# Altium project roach2_project rev2.PrjPCB (part 5 of 13)

## Sheet ppc_net.SchDoc: PowePC Gigabit Ethernet
size A3; Date: DO NOT USE, RATHER USE PROJ OPTIONS; DrawnBy: DO NOT USE, RATHER USE PROJ OPTIONS; Engineer: DO NOT USE, RATHER USE PROJ OPTIONS; Organization: DO NOT USE, RATHER USE PROJ OPTIONS; DocumentNumber: DO NOT USE, RATHER USE PROJ OPTIONS; Revision: DO NOT USE, RATHER USE PROJ OPTIONS; SheetNumber: 11; SheetTotal: 27; SCH_Sheet_Filename: ppc_net.SchDoc; CurrentTime: DO NOT USE, RATHER USE PROJ OPTIONS; Time: DO NOT USE, RATHER USE PROJ OPTIONS; DocumentFullPathAndName: DO NOT USE, RATHER USE PROJ OPTIONS; DocumentName: DO NOT USE, RATHER USE PROJ OPTIONS; ModifiedDate: DO NOT USE, RATHER USE PROJ OPTIONS; ImagePath: DO NOT USE, RATHER USE PROJ OPTIONS
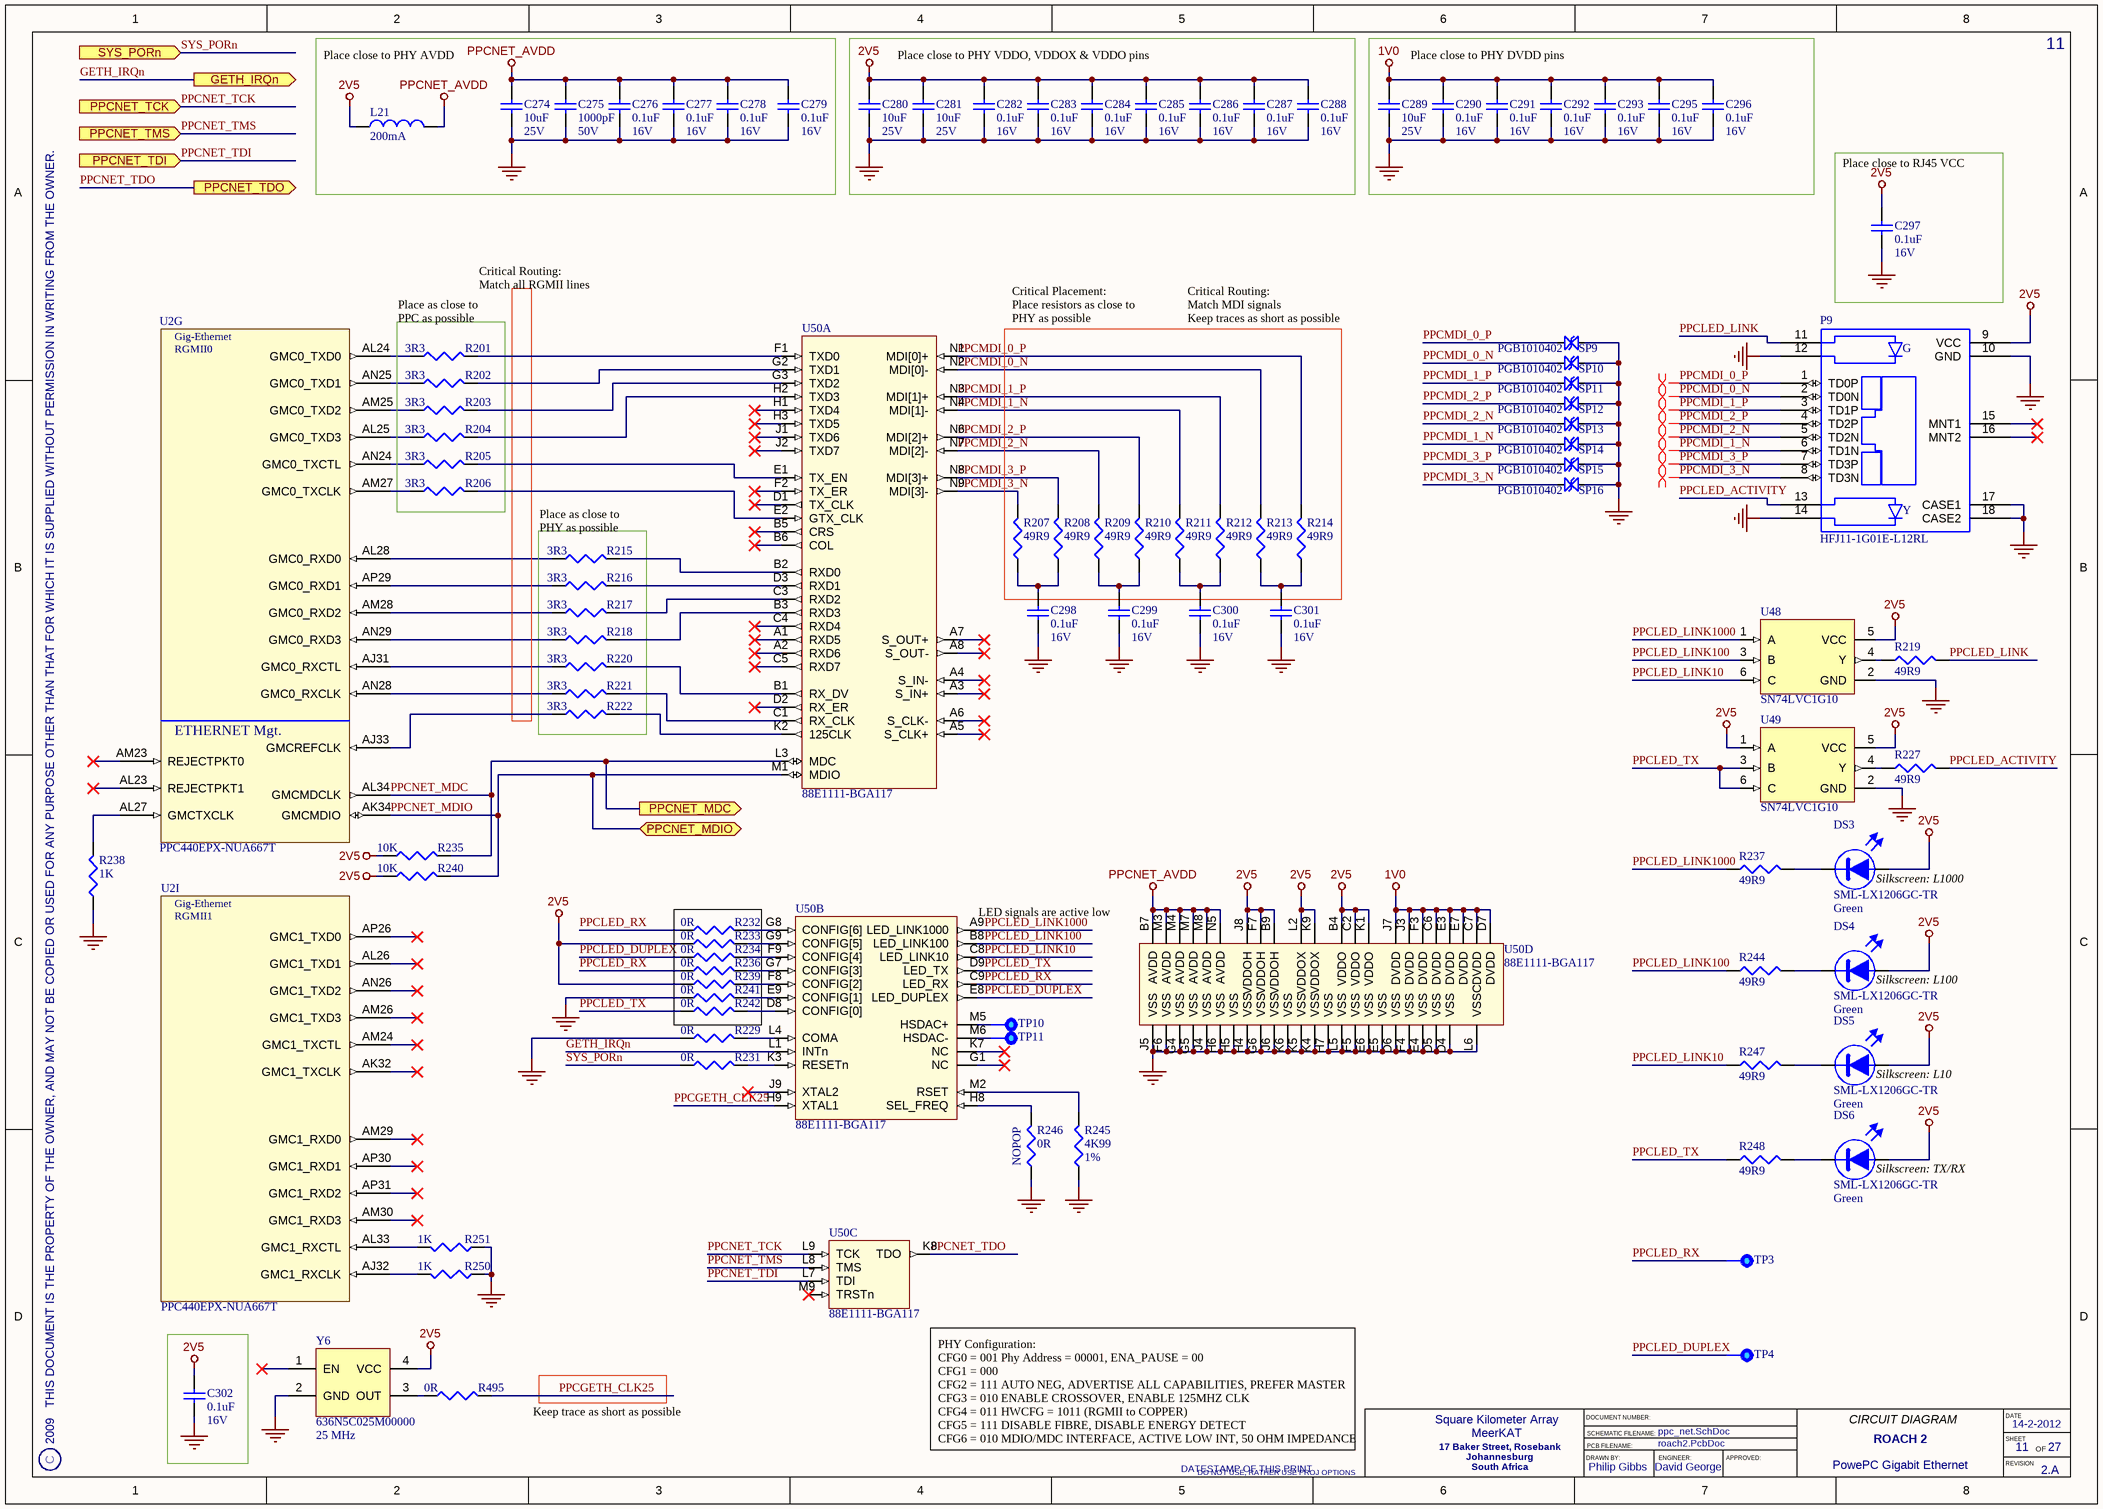
[diagram p8: ppc_net.SchDoc]

### Parts
C274  Rating: 25V  [CAPC3225X200L]  (hidden comment: 10uF)
C275  Rating: 50V  [CAPC1005X55L]  (hidden comment: 1000pF)
C276  Rating: 16V  [CAPC1005X60L]  (hidden comment: 0.1uF)
C277  Rating: 16V  [CAPC1005X60L]  (hidden comment: 0.1uF)
C278  Rating: 16V  [CAPC1005X60L]  (hidden comment: 0.1uF)
C279  Rating: 16V  [CAPC1005X60L]  (hidden comment: 0.1uF)
C280  Rating: 25V  [CAPC3225X200L]  (hidden comment: 10uF)
C281  Rating: 25V  [CAPC3225X200L]  (hidden comment: 10uF)
C282  Rating: 16V  [CAPC1005X60L]  (hidden comment: 0.1uF)
C283  Rating: 16V  [CAPC1005X60L]  (hidden comment: 0.1uF)
C284  Rating: 16V  [CAPC1005X60L]  (hidden comment: 0.1uF)
C285  Rating: 16V  [CAPC1005X60L]  (hidden comment: 0.1uF)
C286  Rating: 16V  [CAPC1005X60L]  (hidden comment: 0.1uF)
C287  Rating: 16V  [CAPC1005X60L]  (hidden comment: 0.1uF)
C288  Rating: 16V  [CAPC1005X60L]  (hidden comment: 0.1uF)
C289  Rating: 25V  [CAPC3225X200L]  (hidden comment: 10uF)
C290  Rating: 16V  [CAPC1005X60L]  (hidden comment: 0.1uF)
C291  Rating: 16V  [CAPC1005X60L]  (hidden comment: 0.1uF)
C292  Rating: 16V  [CAPC1005X60L]  (hidden comment: 0.1uF)
C293  Rating: 16V  [CAPC1005X60L]  (hidden comment: 0.1uF)
C295  Rating: 16V  [CAPC1005X60L]  (hidden comment: 0.1uF)
C296  Rating: 16V  [CAPC1005X60L]  (hidden comment: 0.1uF)
C297  Rating: 16V  [CAPC1005X60L]  (hidden comment: 0.1uF)
C298  Rating: 16V  [CAPC1005X60L]  (hidden comment: 0.1uF)
C299  Rating: 16V  [CAPC1005X60L]  (hidden comment: 0.1uF)
C300  Rating: 16V  [CAPC1005X60L]  (hidden comment: 0.1uF)
C301  Rating: 16V  [CAPC1005X60L]  (hidden comment: 0.1uF)
C302  Rating: 16V  [CAPC1005X60L]  (hidden comment: 0.1uF)
DS3  SML-LX1206GC-TR  Colour: Green  [LEDC3216X120N]
DS4  SML-LX1206GC-TR  Colour: Green  [LEDC3216X120N]
DS5  SML-LX1206GC-TR  Colour: Green  [LEDC3216X120N]
DS6  SML-LX1206GC-TR  Colour: Green  [LEDC3216X120N]
L21  Rating: 200mA  [INDC2012X130L]  (hidden comment: 600R)
P9  HFJ11-1G01E-L12RL  [HALO_HFJ11-1G02E-L55]
R201  3R3  [RESC1005X40L]
R202  3R3  [RESC1005X40L]
R203  3R3  [RESC1005X40L]
R204  3R3  [RESC1005X40L]
R205  3R3  [RESC1005X40L]
R206  3R3  [RESC1005X40L]
R207  49R9  [RESC1005X40L]
R208  49R9  [RESC1005X40L]
R209  49R9  [RESC1005X40L]
R210  49R9  [RESC1005X40L]
R211  49R9  [RESC1005X40L]
R212  49R9  [RESC1005X40L]
R213  49R9  [RESC1005X40L]
R214  49R9  [RESC1005X40L]
R215  3R3  [RESC1005X40L]
R216  3R3  [RESC1005X40L]
R217  3R3  [RESC1005X40L]
R218  3R3  [RESC1005X40L]
R219  49R9  [RESC1005X40L]
R220  3R3  [RESC1005X40L]
R221  3R3  [RESC1005X40L]
R222  3R3  [RESC1005X40L]
R227  49R9  [RESC1005X40L]
R229  0R  [RESC1005X40L]
R231  0R  [RESC1005X40L]
R232  0R  [RESC1005X40L]
R233  0R  [RESC1005X40L]
R234  0R  [RESC1005X40L]
R235  10K  [RESC1005X40L]
R236  0R  [RESC1005X40L]
R237  49R9  [RESC1005X40L]
R238  1K  [RESC1005X40L]
R239  0R  [RESC1005X40L]
R240  10K  [RESC1005X40L]
R241  0R  [RESC1005X40L]
R242  0R  [RESC1005X40L]
R244  49R9  [RESC1005X40L]
R245  Tolerance: 1%  [RESC1005X40L]  (hidden comment: 4K99)
R246  0R  [RESC1005X40L]
R247  49R9  [RESC1005X40L]
R248  49R9  [RESC1005X40L]
R250  1K  [RESC1005X40L]
R251  1K  [RESC1005X40L]
R495  0R  [RESC1005X40L]
SP9  PGB1010402  [PGB1010402]
SP10  PGB1010402  [PGB1010402]
SP11  PGB1010402  [PGB1010402]
SP12  PGB1010402  [PGB1010402]
SP13  PGB1010402  [PGB1010402]
SP14  PGB1010402  [PGB1010402]
SP15  PGB1010402  [PGB1010402]
SP16  PGB1010402  [PGB1010402]
TP3  Testpoint  [TP100]  (value not drawn)  (no BOM)
TP4  Testpoint  [TP100]  (value not drawn)  (no BOM)
TP10  Testpoint  [TP100]  (value not drawn)  (no BOM)
TP11  Testpoint  [TP100]  (value not drawn)  (no BOM)
U2  PPC440EPX-NUA667T  [TE-PBGA680]  (parts G,I of 11)
U48  SN74LVC1G10  [SOT23-6]
U49  SN74LVC1G10  [SOT23-6]
U50  88E1111-BGA117  [BGA117C100P13X9_1400X1000X154]  (parts A,B,C,D of 4)
Y6  Frequency: 25 MHz  [636XXXXXXMXXXXX]  (hidden comment: 636N5C025M00000)

### Ports
GETH_IRQn (out), PPCNET_MDC (out), PPCNET_MDIO (bidir), PPCNET_TCK (in), PPCNET_TDI (in), PPCNET_TDO (out), PPCNET_TMS (in), SYS_PORn (in)

### Nets
1V0: C289.2 C290.2 C291.2 C292.2 C293.2 C295.2 C296.2 U50.C6(DVDD) U50.C7(DVDD) U50.D7(DVDD) U50.E3(DVDD) U50.E7(DVDD) U50.F3(DVDD) U50.J3(DVDD) U50.J7(DVDD)
2V5: C280.2 C281.2 C282.2 C283.2 C284.2 C285.2 C286.2 C287.2 C288.2 C297.2 C302.2 DS3.2(A) DS4.2(A) DS5.2(A) DS6.2(A) L21.1 P9.9(VCC) R233.1 R235.1 R239.1 R240.1 U48.5(VCC) U49.1(A) U49.5(VCC) U50.B4(VDDO) U50.B9(VDDOH) U50.C2(VDDO) U50.F7(VDDOH) U50.J8(VDDOH) U50.K1(VDDO) U50.K9(VDDOX) U50.L2(VDDOX) Y6.4(VCC)
GND: C274.1 C275.1 C276.1 C277.1 C278.1 C279.1 C280.1 C281.1 C282.1 C283.1 C284.1 C285.1 C286.1 C287.1 C288.1 C289.1 C290.1 C291.1 C292.1 C293.1 C295.1 C296.1 C297.1 C298.2 C299.2 C300.2 C301.2 C302.1 P9.10(GND) P9.12(R1_YA_GC) P9.14(L1_YA_GC) P9.17(CASE1) P9.18(CASE2) R229.1 R238.1 R241.1 R245.1 R246.1 R250.1 R251.1 SP9.1(A) SP10.1(A) SP11.1(A) SP12.1(A) SP13.1(A) SP14.1(A) SP15.1(A) SP16.1(A) U48.2(GND) U49.2(GND) U50.D4(VSS) U50.D5(VSS) U50.D6(VSS) U50.E4(VSS) U50.E5(VSS) U50.E6(VSS) U50.F4(VSS) U50.F5(VSS) U50.F6(VSS) U50.G4(VSS) U50.G5(VSS) U50.G6(VSS) U50.H4(VSS) U50.H5(VSS) U50.H6(VSS) U50.H7(VSS) U50.J4(VSS) U50.J5(VSS) U50.J6(VSS) U50.K4(VSS) U50.K5(VSS) U50.K6(VSS) U50.L5(VSS) U50.L6(VSSC) Y6.2(GND)
PPCNET_AVDD: C274.2 C275.2 C276.2 C277.2 C278.2 C279.2 L21.2 U50.B7(AVDD) U50.M3(AVDD) U50.M4(AVDD) U50.M7(AVDD) U50.M8(AVDD) U50.N5(AVDD)
GETH_IRQn: U50.L1(INTn) ; port GETH_IRQn
PPCGETH_CLK25: R495.2 U50.H9(XTAL1)
PPCLED_ACTIVITY: P9.13(L1_YC_GA) R227.2
PPCLED_DUPLEX: R234.1 TP4.1 U50.E8(LED_DUPLEX)
PPCLED_LINK: P9.11(R1_YC_GA) R219.2
PPCLED_LINK10: R247.1 U48.6(C) U50.C8(LED_LINK10)
PPCLED_LINK100: R244.1 U48.3(B) U50.B8(LED_LINK100)
PPCLED_LINK1000: R237.1 U48.1(A) U50.A9(LED_LINK1000)
PPCLED_RX: R232.1 R236.1 TP3.1 U50.C9(LED_RX)
PPCLED_TX: R242.1 R248.1 U49.3(B) U49.6(C) U50.D9(LED_TX)
PPCMDI_0_N: P9.2(TD0N) R213.2 SP10.2(B) U50.N2(MDI[0]-)
PPCMDI_0_P: P9.1(TD0P) R214.2 SP9.2(B) U50.N1(MDI[0]+)
PPCMDI_1_N: P9.6(TD1N) R211.2 SP14.2(B) U50.N4(MDI[1]-)
PPCMDI_1_P: P9.3(TD1P) R212.2 SP11.2(B) U50.N3(MDI[1]+)
PPCMDI_2_N: P9.5(TD2N) R209.2 SP13.2(B) U50.N7(MDI[2]-)
PPCMDI_2_P: P9.4(TD2P) R210.2 SP12.2(B) U50.N6(MDI[2]+)
PPCMDI_3_N: P9.8(TD3N) R207.2 SP16.2(B) U50.N9(MDI[3]-)
PPCMDI_3_P: P9.7(TD3P) R208.2 SP15.2(B) U50.N8(MDI[3]+)
PPCNET_MDC: R235.2 U2.AL34(GMCMDCLK) U50.L3(MDC) ; port PPCNET_MDC
PPCNET_MDIO: R240.2 U2.AK34(GMCMDIO) U50.M1(MDIO) ; port PPCNET_MDIO
PPCNET_TCK: U50.L9(TCK) ; port PPCNET_TCK
PPCNET_TDI: U50.L7(TDI) ; port PPCNET_TDI
PPCNET_TDO: U50.K8(TDO) ; port PPCNET_TDO
PPCNET_TMS: U50.L8(TMS) ; port PPCNET_TMS
SYS_PORn: R231.1 ; port SYS_PORn
NetC298_1: C298.1 R207.1 R208.1
NetC299_1: C299.1 R209.1 R210.1
NetC300_1: C300.1 R211.1 R212.1
NetC301_1: C301.1 R213.1 R214.1
NetDS3_1: DS3.1(K) R237.2
NetDS4_1: DS4.1(K) R244.2
NetDS5_1: DS5.1(K) R247.2
NetDS6_1: DS6.1(K) R248.2
NetR201_1: R201.1 U2.AL24(GMC0_TXD0)
NetR201_2: R201.2 U50.F1(TXD0)
NetR202_1: R202.1 U2.AN25(GMC0_TXD1)
NetR202_2: R202.2 U50.G2(TXD1)
NetR203_1: R203.1 U2.AM25(GMC0_TXD2)
NetR203_2: R203.2 U50.G3(TXD2)
NetR204_1: R204.1 U2.AL25(GMC0_TXD3)
NetR204_2: R204.2 U50.H2(TXD3)
NetR205_1: R205.1 U2.AN24(GMC0_TXCTL)
NetR205_2: R205.2 U50.E1(TX_EN)
NetR206_1: R206.1 U2.AM27(GMC0_TXCLK)
NetR206_2: R206.2 U50.E2(GTX_CLK)
NetR215_1: R215.1 U2.AL28(GMC0_RXD0)
NetR215_2: R215.2 U50.B2(RXD0)
NetR216_1: R216.1 U2.AP29(GMC0_RXD1)
NetR216_2: R216.2 U50.D3(RXD1)
NetR217_1: R217.1 U2.AM28(GMC0_RXD2)
NetR217_2: R217.2 U50.C3(RXD2)
NetR218_1: R218.1 U2.AN29(GMC0_RXD3)
NetR218_2: R218.2 U50.B3(RXD3)
NetR219_1: R219.1 U48.4(Y)
NetR220_1: R220.1 U2.AJ31(GMC0_RXCTL)
NetR220_2: R220.2 U50.B1(RX_DV)
NetR221_1: R221.1 U2.AN28(GMC0_RXCLK)
NetR221_2: R221.2 U50.C1(RX_CLK)
NetR222_1: R222.1 U2.AJ33(GMCREFCLK)
NetR222_2: R222.2 U50.K2(125CLK)
NetR227_1: R227.1 U49.4(Y)
NetR229_2: R229.2 U50.L4(COMA)
NetR231_2: R231.2 U50.K3(RESETn)
NetR232_2: R232.2 U50.G8(CONFIG[6])
NetR233_2: R233.2 U50.G9(CONFIG[5])
NetR234_2: R234.2 U50.F9(CONFIG[4])
NetR236_2: R236.2 U50.G7(CONFIG[3])
NetR238_2: R238.2 U2.AL27(GMCTXCLK)
NetR239_2: R239.2 U50.F8(CONFIG[2])
NetR241_2: R241.2 U50.E9(CONFIG[1])
NetR242_2: R242.2 U50.D8(CONFIG[0])
NetR245_2: R245.2 U50.M2(RSET)
NetR246_2: R246.2 U50.H8(SEL_FREQ)
NetR250_2: R250.2 U2.AJ32(GMC1_RXCLK)
NetR251_2: R251.2 U2.AL33(GMC1_RXCTL)
NetR495_1: R495.1 Y6.3(OUT)
NetTP10_1: TP10.1 U50.M5(HSDAC+)
NetTP11_1: TP11.1 U50.M6(HSDAC-)

Not connected (* = marked no-connect by the designer): P9 15(MNT1)* 16(MNT2)*; U2 AK32(GMC1_TXCLK)* AL23(REJECTPKT1)* AL26(GMC1_TXD1)* AM23(REJECTPKT0)* AM24(GMC1_TXCTL)* AM26(GMC1_TXD3)* AM29(GMC1_RXD0)* AM30(GMC1_RXD3)* AN26(GMC1_TXD2)* AP26(GMC1_TXD0)* AP30(GMC1_RXD1)* AP31(GMC1_RXD2)*; U50 A1(RXD5)* A2(RXD6)* A3(S_IN+)* A4(S_IN-)* A5(S_CLK+)* A6(S_CLK-)* A7(S_OUT+)* A8(S_OUT-)* B5(CRS)* B6(COL)* C4(RXD4)* C5(RXD7)* D1(TX_CLK)* D2(RX_ER)* F2(TX_ER)* G1(NC)* H1(TXD4)* H3(TXD5)* J1(TXD6)* J2(TXD7)* J9(XTAL2)* K7(NC)* M9(TRSTn)*; Y6 1(EN)*

### Layout directives
differential pair: PPCMDI_0_N, PPCMDI_0_P, PPCMDI_1_N, PPCMDI_1_P, PPCMDI_2_N, PPCMDI_2_P, PPCMDI_3_N, PPCMDI_3_P

### Notes on the sheet
- Place close to PHY AVDD
- Place close to PHY VDDO, VDDOX & VDDO pins
- Place close to PHY DVDD pins
- (near C297) Place close to RJ45 VCC
- (near R201) Place as close to
  PPC as possible
- Critical Routing:
  Match all RGMII lines
- Critical Placement:
  Place resistors as close to
  PHY as possible
- Critical Routing:
  Match MDI signals
  Keep traces as short as possible
- (near R215) Place as close to
  PHY as possible
- (near U50) LED signals are active low
- (near DS3) Silkscreen: L1000
- (near DS4) Silkscreen: L100
- (near DS5) Silkscreen: L10
- (near R246) NOPOP
- (near DS6) Silkscreen: TX/RX
- Keep trace as short as possible
- (near U50) PHY Configuration:
  CFG0 = 001 Phy Address = 00001, ENA_PAUSE = 00
  CFG1 = 000
  CFG2 = 111 AUTO NEG, ADVERTISE ALL CAPABILITIES, PREFER MASTER
  CFG3 = 010 ENABLE CROSSOVER, ENABLE 125MHZ CLK
  CFG4 = 011 HWCFG = 1011 (RGMII to COPPER)
  CFG5 = 111 DISABLE FIBRE, DISABLE ENERGY DETECT
  CFG6 = 010 MDIO/MDC INTERFACE, ACTIVE LOW INT, 50 OHM IMPEDANCE
- 2009   THIS DOCUMENT IS THE PROPERTY OF THE OWNER, AND MAY NOT BE COPIED OR USED FOR ANY PURPOSE OTHER THAN THAT FOR WHICH IT IS SUPPLIED WITHOUT PERMISSION IN WRITING FROM THE OWNER.
- C
- DATESTAMP OF THIS PRINT
- DRAWN BY:
- DOCUMENT NUMBER:
- SCHEMATIC FILENAME:
- PCB FILENAME:
- ENGINEER:
- APPROVED:
- CIRCUIT DIAGRAM
- DATE
- SHEET
- REVISION
- OF
- (in symbol CONN-PCB-4) G
- (in symbol IC-CPU-1, part G) Gig-Ethernet; RGMII0; ETHERNET Mgt.
- (in symbol IC-CPU-1, part I) Gig-Ethernet; RGMII1

### Library data of the parts
C274 C280 C281 C289 = CAP-CER-5: 10uF, Ceramic Capacitor; Manufacturer: MURATA; PartNum: GRM32DR61E106KA12L; Tolerance: 10%; Dielectric: X5R; POD number: CAP-CER-5; Value: 10uF; RoHS: Y; Sort Value: 100; Category: Capacitors; Subcategory: Ceramic
C275 = CAP-CER-4: 1000pF, Ceramic Capacitor; Manufacturer: MURATA; PartNum: GRM155R61H102KA01D; Tolerance: 10%; Dielectric: X5R; POD number: CAP-CER-4; Value: 1000pF; RoHS: Y; Sort Value: 0.0001; Category: Capacitors; Subcategory: Ceramic
C276-C279 C282-C288 C290-C293 C295-C302 = CAP-CER-1: 0.1uF, Ceramic Capacitor; Manufacturer: VENKEL; PartNum: C0402X7R160-104KN; Tolerance: 10%; Dielectric: X7R; POD number: CAP-CER-1; Value: 0.1uF; RoHS: Y; Sort Value: 0.1; Category: Capacitors; Subcategory: Ceramic
DS3-DS6 = OPTO-LED-0: Green, Surface mount, LED, 1206; Manufacturer: LUMEX; Vdrop: 2.2V; Rating: 20mA; POD number: OPTO-LED-0; PartNum: SML-LX1206GC-TR; RoHS: Y; Category: OPTO; Subcategory: LED
L21 = IND-FB-0: 600 Ohm, Chip Ferrite Bead; Manufacturer: Murata; PartNum: BLM21BD601SN1; DC Res: 0.35R; Tolerance: 25%; POD number: IND-FB-0; RoHS: Y; Value: 600R; Sort Value: 600; Category: Inductors; Subcategory: FerriteBead
P9 = CONN-PCB-4: RJ45 with Integrated magnetic and dual LEDs; Manufacturer: HALO; POD number: CONN-PCB-4; PartNum: HFJ11-1G01E-L12RL; RoHS: Y; Category: CONN; Subcategory: PCB
R201-R206 R215-R218 R220-R222 = RES-TF-24: 3R3, 1.1mm x 0.5mm, Thick Film Resistor; Manufacturer: ROYALOHM; PartNum: 0402WGJ330KT1E; Tolerance: 5%; Rating: 0.0625W; POD number: RES-TF-24; Value: 3R3; Sort Value: 3R3; Category: Resistors; Subcategory: ThickFilm; HelpURL: *.pdf
R207-R214 R219 R227 R237 R244 R247 R248 = RES-TF-10: 49R9, 1.1mm x 0.5mm, Thick Film Resistor; Manufacturer: ROYALOHM; PartNum: 0402WGF499JT1E; Tolerance: 1%; Rating: 0.0625W; POD number: RES-TF-10; Value: 49R9; Sort Value: 49.9; Category: Resistors; Subcategory: ThickFilm; HelpURL: *.pdf
R229 R231-R234 R236 R239 R241 R242 R246 R495 = RES-TF-0: 0R, 1.1mm x 0.5mm, Thick Film Resistor; Manufacturer: ROYALOHM; PartNum: 0402WG00000T1E; Tolerance: 0%; Rating: 0.0625W; POD number: RES-TF-0; Value: 0R; Sort Value: 0; Category: Resistors; Subcategory: ThickFilm; HelpURL: *.pdf
R235 R240 = RES-TF-5: 10K, 1.1mm x 0.5mm, Thick Film Resistor; Manufacturer: ROYALOHM; PartNum: 0402WGJ0103T1E; Tolerance: 5%; Rating: 0.0625W; POD number: RES-TF-5; Value: 10K; Sort Value: 10000; Category: Resistors; Subcategory: ThickFilm; HelpURL: *.pdf
R238 R250 R251 = RES-TF-8: 1K, 1.1mm x 0.5mm, Thick Film Resistor; Manufacturer: ROYALOHM; PartNum: 0402WGJ0102T1E; Tolerance: 5%; Rating: 0.0625W; POD number: RES-TF-8; Value: 1K; Sort Value: 1000; Category: Resistors; Subcategory: ThickFilm; HelpURL: *.pdf
R245 = RES-TF-13: 4K99, 1.1mm x 0.5mm, Thick Film Resistor; Manufacturer: ROYALOHM; PartNum: 0402WGF4991T1E; Rating: 0.0625W; POD number: RES-TF-13; Value: 4K99; Sort Value: 4990; Category: Resistors; Subcategory: ThickFilm; HelpURL: *.pdf
SP9-SP16 = ELMECH-ESD-3: Surface Mount Polymeric ESD Suppressor in an 0402 package; POD number: ELMECH-ESD-3; PartNum: PGB1010402
TP3 TP4 TP10 TP11 = ELMECH-TP-0: 1mm Diameter, through-hole, Circular Test-point; POD number: ELMECH-TP-0; RoHS: Y; Category: ELMECH; Subcategory: Test Points
U2 = IC-CPU-1: 667MHz, non-RoHS, PPC440EPx uProcessor; Manufacturer: Applied Micro; POD number: IC-CPU-1; PartNum: PPC440EPX-NUA667T; RoHS: Y; Category: IC; Subcategory: CPU
U48 U49 = IC-LOG-3: Single 3-input Positive-NAND gate; Manufacturer: Texas Instruments; POD number: IC-LOG-3; PartNum: SN74LVC1G10; RoHS: Y; Category: IC; Subcategory: Logic
U50 = IC-PHY-1: Integrated 10/100/1000 Ultra Gigabit Ethernet Transceiver; Manufacturer: Marvell; PartNum: 88E1111-XX-BAB1C000; POD number: IC-PHY-1; RoHS: Y; Category: IC; Subcategory: Network PHY
Y6 = RESN-CLK-5: 25.00 MHz, 2V5, CTS 636 clock oscillator; Stability: 50 PPM; POD number: RESN-CLK-5; PartNum: 636N5C025M00000; Manufacturer: CTS; RoHS: Y; Category: RESN; Subcategory: Clock Oscillators

## Sheet ppc_serial.SchDoc: PowerPC Serial Interfaces
size A3; Date: DO NOT USE, RATHER USE PROJ OPTIONS; DrawnBy: DO NOT USE, RATHER USE PROJ OPTIONS; Engineer: DO NOT USE, RATHER USE PROJ OPTIONS; Organization: DO NOT USE, RATHER USE PROJ OPTIONS; DocumentNumber: DO NOT USE, RATHER USE PROJ OPTIONS; Revision: DO NOT USE, RATHER USE PROJ OPTIONS; SheetNumber: 7; SheetTotal: 27; SCH_Sheet_Filename: ppc_serial.SchDoc; CurrentTime: DO NOT USE, RATHER USE PROJ OPTIONS; Time: DO NOT USE, RATHER USE PROJ OPTIONS; DocumentFullPathAndName: DO NOT USE, RATHER USE PROJ OPTIONS; DocumentName: DO NOT USE, RATHER USE PROJ OPTIONS; ModifiedDate: DO NOT USE, RATHER USE PROJ OPTIONS; ImagePath: DO NOT USE, RATHER USE PROJ OPTIONS
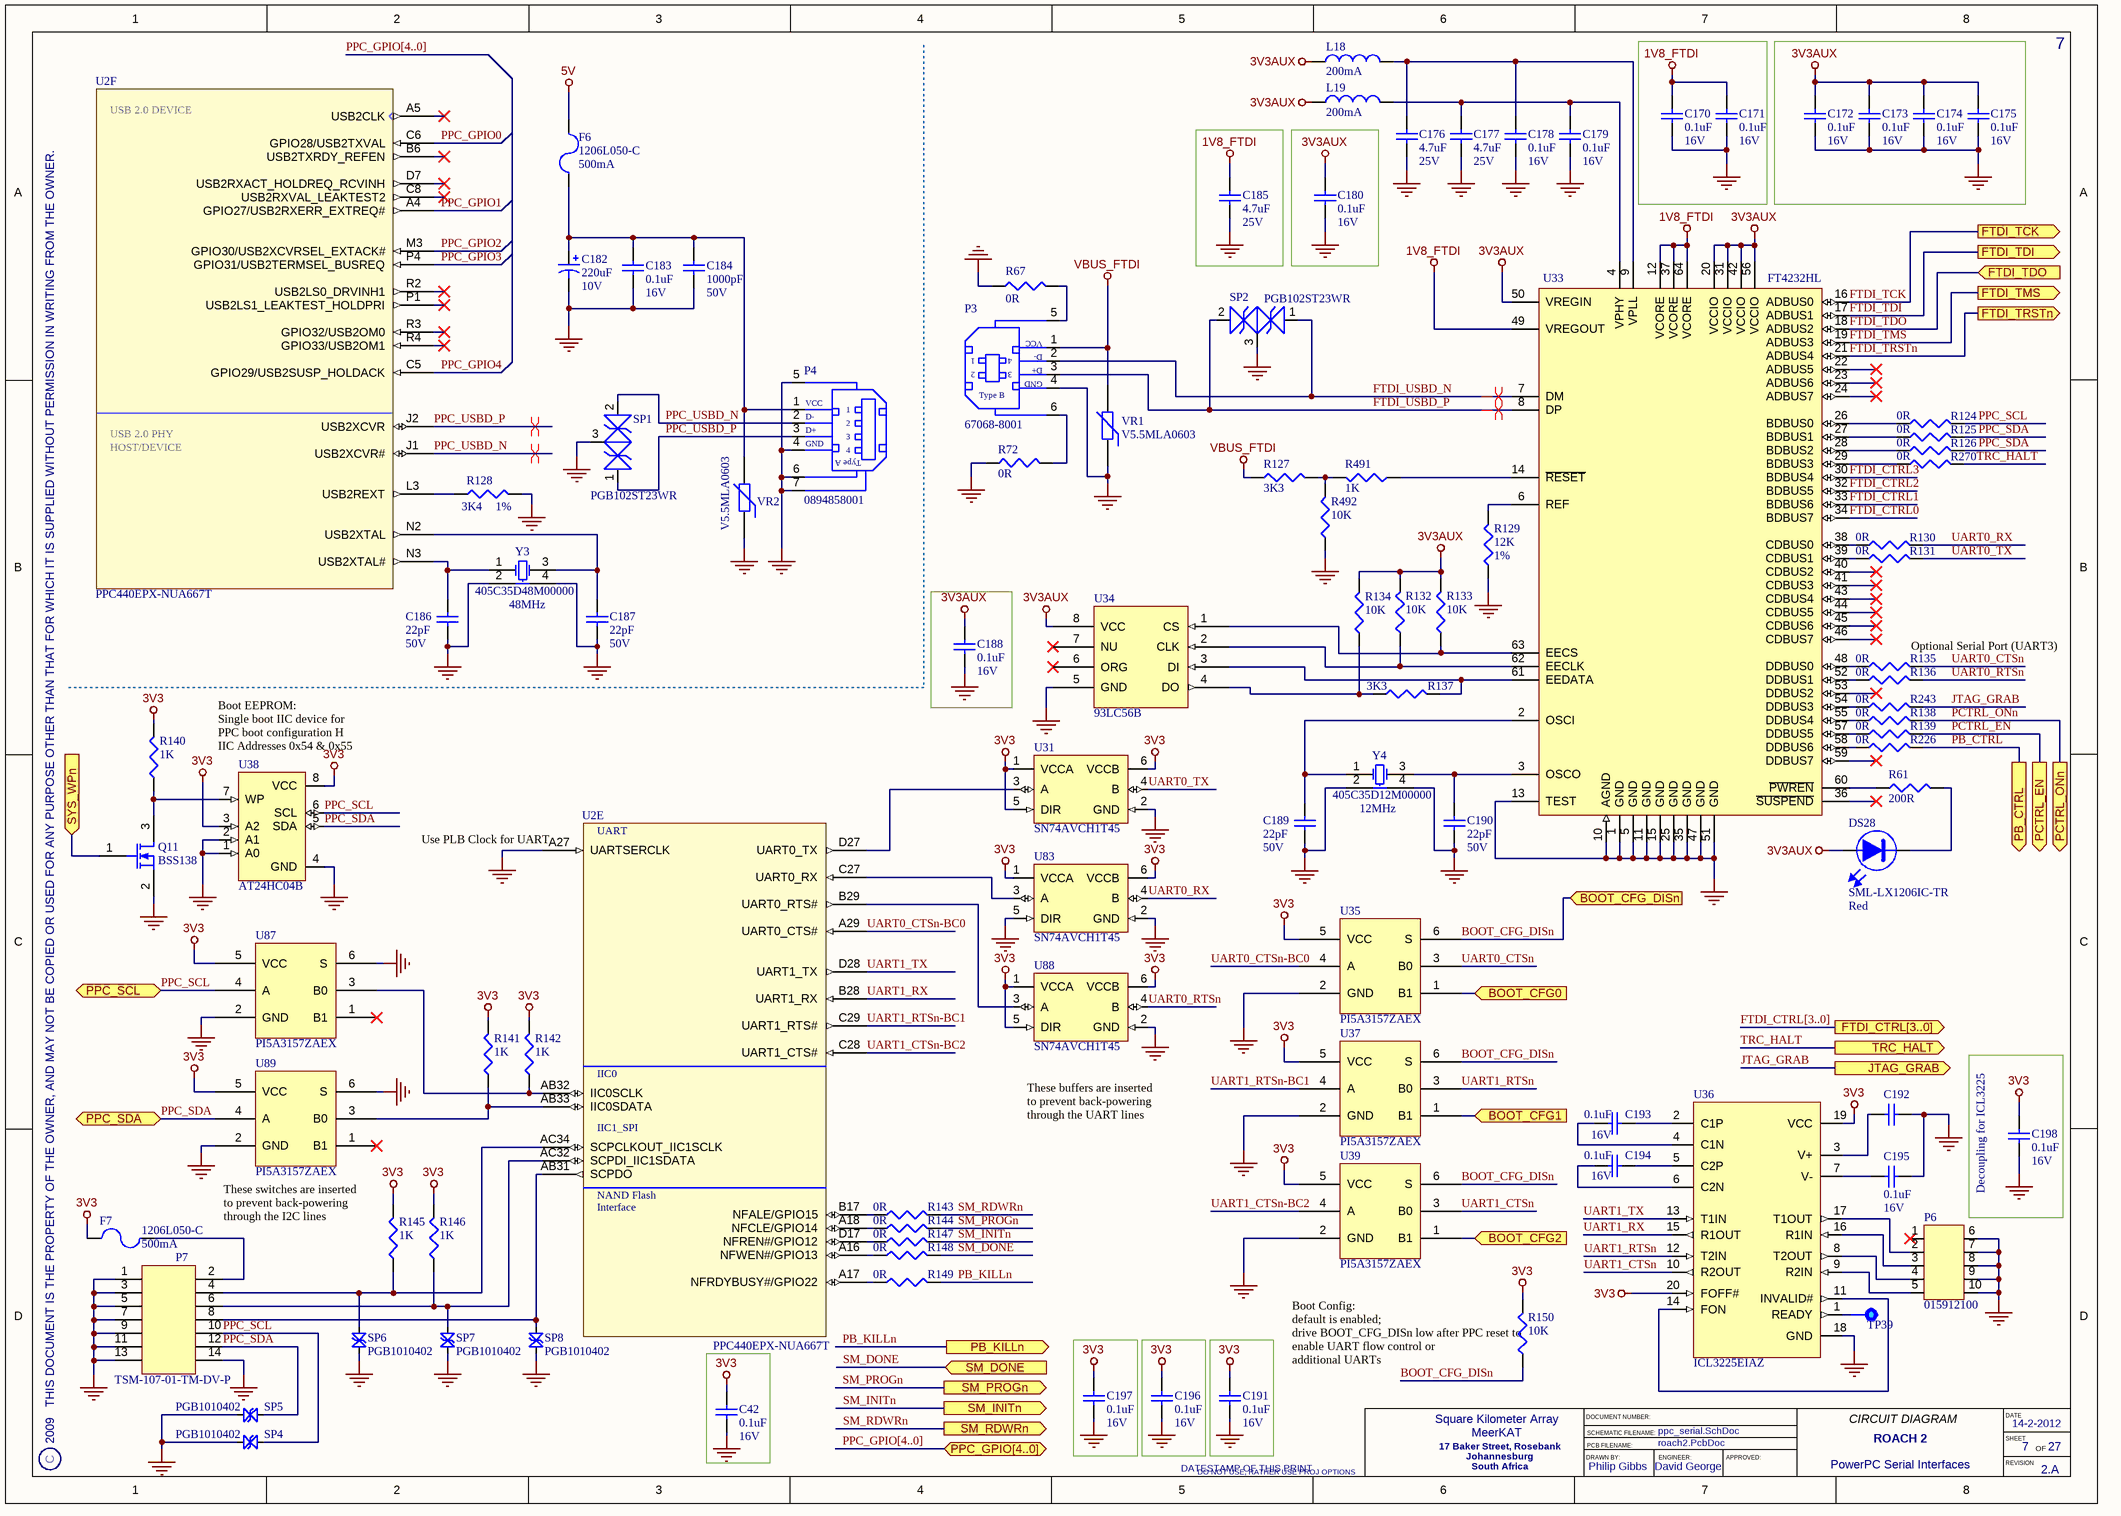
[diagram p9: ppc_serial.SchDoc]

### Parts
(Parts that share a designator on the sheet are numbered #1, #2 ... from top to bottom, then left to right.)
C42  Rating: 16V  [CAPC1005X60L]  (hidden comment: 0.1uF)
C170  Rating: 16V  [CAPC1005X60L]  (hidden comment: 0.1uF)
C171  Rating: 16V  [CAPC1005X60L]  (hidden comment: 0.1uF)
C172  Rating: 16V  [CAPC1005X60L]  (hidden comment: 0.1uF)
C173  Rating: 16V  [CAPC1005X60L]  (hidden comment: 0.1uF)
C174  Rating: 16V  [CAPC1005X60L]  (hidden comment: 0.1uF)
C175  Rating: 16V  [CAPC1005X60L]  (hidden comment: 0.1uF)
C176  Rating: 25V  [CAPC2012X127L]  (hidden comment: 4.7uF)
C177  Rating: 25V  [CAPC2012X127L]  (hidden comment: 4.7uF)
C178  Rating: 16V  [CAPC1005X60L]  (hidden comment: 0.1uF)
C179  Rating: 16V  [CAPC1005X60L]  (hidden comment: 0.1uF)
C180  Rating: 16V  [CAPC1005X60L]  (hidden comment: 0.1uF)
C182  Rating: 10V  [CAPMP7343X430L]  (hidden comment: 220uF)
C183  Rating: 16V  [CAPC1005X60L]  (hidden comment: 0.1uF)
C184  Rating: 50V  [CAPC1005X55L]  (hidden comment: 1000pF)
C185  Rating: 25V  [CAPC2012X127L]  (hidden comment: 4.7uF)
C186  Rating: 50V  [CAPC1005X55L]  (hidden comment: 22pF)
C187  Rating: 50V  [CAPC1005X55L]  (hidden comment: 22pF)
C188  Rating: 16V  [CAPC1005X60L]  (hidden comment: 0.1uF)
C189  Rating: 50V  [CAPC1005X55L]  (hidden comment: 22pF)
C190  Rating: 50V  [CAPC1005X55L]  (hidden comment: 22pF)
C191  Rating: 16V  [CAPC1005X60L]  (hidden comment: 0.1uF)
C192  (no value)  [CAPC1005X60L]
C193  Rating: 16V  [CAPC1005X60L]  (hidden comment: 0.1uF)
C194  Rating: 16V  [CAPC1005X60L]  (hidden comment: 0.1uF)
C195  Rating: 16V  [CAPC1005X60L]  (hidden comment: 0.1uF)
C196  Rating: 16V  [CAPC1005X60L]  (hidden comment: 0.1uF)
C197  Rating: 16V  [CAPC1005X60L]  (hidden comment: 0.1uF)
C198  Rating: 16V  [CAPC1005X60L]  (hidden comment: 0.1uF)
DS28  SML-LX1206IC-TR  Colour: Red  [LEDC3216X120N]
F6  Rating: 500mA  [FUSMC3215X145]  (hidden comment: 1206L050-C)
F7  Rating: 500mA  [FUSMC3215X145]  (hidden comment: 1206L050-C)
L18  Rating: 200mA  [INDC2012X130L]  (hidden comment: 600R)
L19  Rating: 200mA  [INDC2012X130L]  (hidden comment: 600R)
P3  67068-8001  [MOLEX_67068-8001]
P4  USB_TYPEA_TYCO  [MOLEX_0894858001]  (value not drawn)
P6  015912100  [MOLEX_0015912100]
P7  TSM-107-01-TM-DV-P  [SAMTEC_TSM-107-01-TM-DV-P]
Q11  BSS138  [SOT95P245X110-3N]
R61  200R  [RESC1005X40L]
R67  0R  [RESC1005X40L]
R72  0R  [RESC1005X40L]
R124  0R  [RESC1005X40L]
R125  0R  [RESC1005X40L]
R126  0R  [RESC1005X40L]
R127  3K3  [RESC1005X40L]
R128  Tolerance: 1%  [RESC1005X40L]  (hidden comment: 3K4)
R129  Tolerance: 1%  [RESC1005X40L]  (hidden comment: 12K)
R130  0R  [RESC1005X40L]
R131  0R  [RESC1005X40L]
R132  10K  [RESC1005X40L]
R133  10K  [RESC1005X40L]
R134  10K  [RESC1005X40L]
R135#2  0R  [RESC1005X40L]
R136#2  0R  [RESC1005X40L]
R137  3K3  [RESC1005X40L]
R138  0R  [RESC1005X40L]
R139  0R  [RESC1005X40L]
R140  1K  [RESC1005X40L]
R141  1K  [RESC1005X40L]
R142  1K  [RESC1005X40L]
R143  0R  [RESC1005X40L]
R144  0R  [RESC1005X40L]
R145  1K  [RESC1005X40L]
R146  1K  [RESC1005X40L]
R147  0R  [RESC1005X40L]
R148  0R  [RESC1005X40L]
R149  0R  [RESC1005X40L]
R150  10K  [RESC1005X40L]
R226  0R  [RESC1005X40L]
R243  0R  [RESC1005X40L]
R270  0R  [RESC1005X40L]
R491  1K  [RESC1005X40L]
R492  10K  [RESC1005X40L]
SP1  PGB102ST23WR  [SOT95P245X110-3N]
SP2  PGB102ST23WR  [SOT95P245X110-3N]
SP4  PGB1010402  [PGB1010402]
SP5  PGB1010402  [PGB1010402]
SP6  PGB1010402  [PGB1010402]
SP7  PGB1010402  [PGB1010402]
SP8  PGB1010402  [PGB1010402]
TP39  Testpoint  [TP100]  (value not drawn)  (no BOM)
U2  PPC440EPX-NUA667T  [TE-PBGA680]  (parts E,F of 11)
U31  SN74AVCH1T45  [SOT23-6]
U33  FT4232HL  [QFN64]
U34  93LC56B  [SOIC150-8_N]
U35  PI5A3157ZAEX  [SC70-6]
U36  ICL3225EIAZ  [SSOP20_M]
U37  PI5A3157ZAEX  [SC70-6]
U38  AT24HC04B  [TSSOP-8A2]
U39  PI5A3157ZAEX  [SC70-6]
U83  SN74AVCH1T45  [SOT23-6]
U87  PI5A3157ZAEX  [SC70-6]
U88  SN74AVCH1T45  [SOT23-6]
U89  PI5A3157ZAEX  [SC70-6]
VR1  V5.5MLA0603  [VAR_V5_5MLA0603]
VR2  V5.5MLA0603  [VAR_V5_5MLA0603]
Y3  PartNum: 405C35D48M00000  Frequency: 48MHz  [405XXXXXXMXXXXX]  (hidden comment: 405XXXXXXMXXXXX)
Y4  Frequency: 12MHz  [405XXXXXXMXXXXX]  (hidden comment: 405C35D12M00000)

### Blocks framed on the sheet
Decoupling for ICL3225: C198

### Ports
BOOT_CFG0 (in), BOOT_CFG1 (in), BOOT_CFG2 (in), BOOT_CFG_DISn (in), FTDI_CTRL[3..0] (out), FTDI_TCK (out), FTDI_TDI (out), FTDI_TDO (in), FTDI_TMS (out), FTDI_TRSTn (out), JTAG_GRAB (out), PB_CTRL (out), PB_KILLn (out), PCTRL_EN (out), PCTRL_ONn (out), PPC_GPIO[4..0] (bidir), PPC_SCL (bidir), PPC_SDA (bidir), SM_DONE (in), SM_INITn (out), SM_PROGn (out), SM_RDWRn (out), SYS_WPn (in), TRC_HALT (out)

### Nets
1V8_FTDI: C170.2 C171.2 C185.2 U33.12(VCORE) U33.37(VCORE) U33.49(VREGOUT) U33.64(VCORE)
3V3: C42.2 C191.2 C196.2 C197.2 C198.2 F7.2 R140.2 R141.2 R142.2 R145.2 R146.2 R150.2 U31.1(VCCA) U31.5(DIR) U31.6(VCCB) U35.5(VCC) U36.19(VCC) U36.20(FOFF#) U37.5(VCC) U38.3(A2) U38.8(VCC) U39.5(VCC) U83.1(VCCA) U83.6(VCCB) U87.5(VCC) U88.1(VCCA) U88.5(DIR) U88.6(VCCB) U89.5(VCC)
3V3AUX: C172.2 C173.2 C174.2 C175.2 C180.2 C188.2 DS28.2(A) L18.1 L19.1 R132.2 R133.2 R134.2 U33.20(VCCIO) U33.31(VCCIO) U33.42(VCCIO) U33.50(VREGIN) U33.56(VCCIO) U34.8(VCC)
5V: F6.2
GND: C42.1 C170.1 C171.1 C172.1 C173.1 C174.1 C175.1 C176.1 C177.1 C178.1 C179.1 C180.1 C182.2 C183.1 C184.1 C185.1 C186.1 C187.1 C188.1 C189.1 C190.1 C191.1 C192.1 C195.1 C196.1 C197.1 C198.1 P3.4 P4.4 P4.5 P4.6 P4.7 P6.6 P6.7 P6.8 P6.9 P6.10 P7.1 P7.3 P7.5 P7.7 P7.9 P7.11 P7.13 P7.14 Q11.2(S) R67.1 R72.1 R128.2 R129.1 R492.1 SP1.3(COM) SP2.3(COM) SP4.2(B) SP5.2(B) SP6.1(A) SP7.1(A) SP8.1(A) U2.A27(UARTSERCLK) U31.2(GND) U33.1(GND) U33.5(GND) U33.10(AGND) U33.11(GND) U33.13(TEST) U33.15(GND) U33.25(GND) U33.35(GND) U33.47(GND) U33.51(GND) U34.5(GND) U35.2(GND) U36.18(GND) U37.2(GND) U38.1(A0) U38.2(A1) U38.4(GND) U39.2(GND) U83.2(GND) U83.5(DIR) U87.2(GND) U87.6(S) U88.2(GND) U89.2(GND) U89.6(S) VR1.1 VR2.1 Y3.2 Y3.4 Y4.2 Y4.4
VBUS_FTDI: P3.1 R127.1 VR1.2
BOOT_CFG0: U35.1(B1) ; port BOOT_CFG0
BOOT_CFG1: U37.1(B1) ; port BOOT_CFG1
BOOT_CFG2: U39.1(B1) ; port BOOT_CFG2
BOOT_CFG_DISn: R150.1 U35.6(S) U37.6(S) U39.6(S) ; port BOOT_CFG_DISn
FTDI_CTRL0: U33.34(BDBUS7)
FTDI_CTRL1: U33.33(BDBUS6)
FTDI_CTRL2: U33.32(BDBUS5)
FTDI_CTRL3: U33.30(BDBUS4)
FTDI_TCK: U33.16(ADBUS0) ; port FTDI_TCK
FTDI_TDI: U33.17(ADBUS1) ; port FTDI_TDI
FTDI_TDO: U33.18(ADBUS2) ; port FTDI_TDO
FTDI_TMS: U33.19(ADBUS3) ; port FTDI_TMS
FTDI_TRSTn: U33.21(ADBUS4) ; port FTDI_TRSTn
FTDI_USBD_N: P3.2 SP2.1(A) U33.7(DM)
FTDI_USBD_P: P3.3 SP2.2(B) U33.8(DP)
JTAG_GRAB: R243.2 ; port JTAG_GRAB
PB_CTRL: R226.2 ; port PB_CTRL
PB_KILLn: R149.2 ; port PB_KILLn
PCTRL_EN: R139.2 ; port PCTRL_EN
PCTRL_ONn: R138.2 ; port PCTRL_ONn
PPC_GPIO0: U2.C6(GPIO28/USB2TXVAL)
PPC_GPIO1: U2.A4(GPIO27/USB2RXERR_EXTREQ#)
PPC_GPIO2: U2.M3(GPIO30/USB2XCVRSEL_EXTACK#)
PPC_GPIO3: U2.P4(GPIO31/USB2TERMSEL_BUSREQ)
PPC_GPIO4: U2.C5(GPIO29/USB2SUSP_HOLDACK)
PPC_SCL: P7.10 R124.2 SP4.1(A) U38.6(SCL) U87.4(A) ; port PPC_SCL
PPC_SDA: P7.12 R125.2 R126.2 SP5.1(A) U38.5(SDA) U89.4(A) ; port PPC_SDA
PPC_USBD_N: P4.2 SP1.2(B) U2.J1(USB2XCVR#)
PPC_USBD_P: P4.3 SP1.1(A) U2.J2(USB2XCVR)
SM_DONE: R148.2 ; port SM_DONE
SM_INITn: R147.2 ; port SM_INITn
SM_PROGn: R144.2 ; port SM_PROGn
SM_RDWRn: R143.2 ; port SM_RDWRn
SYS_WPn: Q11.1(G) ; port SYS_WPn
TRC_HALT: R270.2 ; port TRC_HALT
UART0_CTSn: R135#2.2 U35.3(B0)
UART0_CTSn-BC0: U2.A29(UART0_CTS#) U35.4(A)
UART0_RTSn: R136#2.2 U88.4(B)
UART0_RX: R130.2 U83.4(B)
UART0_TX: R131.2 U31.4(B)
UART1_CTSn: U36.10(R2OUT) U39.3(B0)
UART1_CTSn-BC2: U2.C28(UART1_CTS#) U39.4(A)
UART1_RTSn: U36.12(T2IN) U37.3(B0)
UART1_RTSn-BC1: U2.C29(UART1_RTS#) U37.4(A)
UART1_RX: U2.B28(UART1_RX) U36.15(R1OUT)
UART1_TX: U2.D28(UART1_TX) U36.13(T1IN)
NetC176_2: C176.2 C178.2 L18.2 U33.9(VPLL)
NetC177_2: C177.2 C179.2 L19.2 U33.4(VPHY)
NetC182_1: C182.1 C183.2 C184.2 F6.1 P4.1 VR2.2
NetC186_2: C186.2 U2.N3(USB2XTAL#) Y3.1
NetC187_2: C187.2 U2.N2(USB2XTAL) Y3.3
NetC189_2: C189.2 U33.2(OSCI) Y4.1
NetC190_2: C190.2 U33.3(OSCO) Y4.3
NetC192_2: C192.2 U36.3(V+)
NetC193_1: C193.1 U36.2(C1P)
NetC193_2: C193.2 U36.4(C1N)
NetC194_1: C194.1 U36.5(C2P)
NetC194_2: C194.2 U36.6(C2N)
NetC195_2: C195.2 U36.7(V-)
NetDS28_1: DS28.1(K) R61.2
NetF7_1: F7.1 P7.2
NetP3_5: P3.5 R67.2
NetP3_6: P3.6 R72.2
NetP6_2: P6.2 U36.17(T1OUT)
NetP6_3: P6.3 U36.16(R1IN)
NetP6_4: P6.4 U36.8(T2OUT)
NetP6_5: P6.5 U36.9(R2IN)
NetP7_4: P7.4 R145.1 SP6.2(B) U2.AC34(SCPCLKOUT_IIC1SCLK)
NetP7_6: P7.6 R146.1 SP7.2(B) U2.AC32(SCPDI_IIC1SDATA)
NetP7_8: P7.8 SP8.2(B) U2.AB31(SCPDO)
NetQ11_3: Q11.3(D) R140.1 U38.7(WP)
NetR61_1: R61.1 U33.60(~{PWREN})
NetR124_1: R124.1 U33.26(BDBUS0)
NetR125_1: R125.1 U33.27(BDBUS1)
NetR126_1: R126.1 U33.28(BDBUS2)
NetR127_2: R127.2 R491.2 R492.2
NetR128_1: R128.1 U2.L3(USB2REXT)
NetR129_2: R129.2 U33.6(REF)
NetR130_1: R130.1 U33.38(CDBUS0)
NetR131_1: R131.1 U33.39(CDBUS1)
NetR132_1: R132.1 U33.62(EECLK) U34.2(CLK)
NetR133_1: R133.1 U33.63(EECS) U34.1(CS)
NetR134_1: R134.1 R137.1 U34.4(DO)
NetR135#2_1: R135#2.1 U33.48(DDBUS0)
NetR136#2_1: R136#2.1 U33.52(DDBUS1)
NetR137_2: R137.2 U33.61(EEDATA) U34.3(DI)
NetR138_1: R138.1 U33.55(DDBUS4)
NetR139_1: R139.1 U33.57(DDBUS5)
NetR141_1: R141.1 U2.AB33(IIC0SDATA) U89.3(B0)
NetR142_1: R142.1 U2.AB32(IIC0SCLK) U87.3(B0)
NetR143_1: R143.1 U2.B17(NFALE/GPIO15)
NetR144_1: R144.1 U2.A18(NFCLE/GPIO14)
NetR147_1: R147.1 U2.D17(NFREN#/GPIO12)
NetR148_1: R148.1 U2.A16(NFWEN#/GPIO13)
NetR149_1: R149.1 U2.A17(NFRDYBUSY#/GPIO22)
NetR226_1: R226.1 U33.58(DDBUS6)
NetR243_1: R243.1 U33.54(DDBUS3)
NetR270_1: R270.1 U33.29(BDBUS3)
NetR491_1: R491.1 U33.14(~{RESET})
NetTP39_1: TP39.1 U36.1(READY)
NetU2_B29: U2.B29(UART0_RTS#) U88.3(A)
NetU2_C27: U2.C27(UART0_RX) U83.3(A)
NetU2_D27: U2.D27(UART0_TX) U31.3(A)
NetU36_11: U36.11(INVALID#) U36.14(FON)

Not connected (* = marked no-connect by the designer): P6 1*; U2 A5(USB2CLK)* B6(USB2TXRDY_REFEN)* C8(USB2RXVAL_LEAKTEST2)* D7(USB2RXACT_HOLDREQ_RCVINH)* P1(USB2LS1_LEAKTEST_HOLDPRI)* R2(USB2LS0_DRVINH1)* R3(GPIO32/USB2OM0)* R4(GPIO33/USB2OM1)*; U33 22(ADBUS5)* 23(ADBUS6)* 24(ADBUS7)* 36(~{SUSPEND})* 40(CDBUS2)* 41(CDBUS3)* 43(CDBUS4)* 44(CDBUS5)* 45(CDBUS6)* 46(CDBUS7)* 53(DDBUS2)* 59(DDBUS7)*; U34 6(ORG)* 7(NU)*; U87 1(B1)*; U89 1(B1)*

### Buses and harness runs
bus FTDI_CTRL[3..0] = port FTDI_CTRL[3..0]
bus PPC_GPIO[4..0]
bus PPC_GPIO[4..0] = port PPC_GPIO[4..0]

### Layout directives
differential pair: FTDI_USBD_N, FTDI_USBD_P, PPC_USBD_N, PPC_USBD_P

### Notes on the sheet
- (near R135#2) Optional Serial Port (UART3)
- (near U38) Boot EEPROM:
  Single boot IIC device for
  PPC boot configuration H
  IIC Addresses 0x54 & 0x55
- (near U2) Use PLB Clock for UART
- (near U88) These buffers are inserted
  to prevent back-powering
  through the UART lines
- These switches are inserted
  to prevent back-powering
  through the I2C lines
- (near R150) Boot Config:
  default is enabled;
  drive BOOT_CFG_DISn low after PPC reset to
  enable UART flow control or
  additional UARTs
- 2009   THIS DOCUMENT IS THE PROPERTY OF THE OWNER, AND MAY NOT BE COPIED OR USED FOR ANY PURPOSE OTHER THAN THAT FOR WHICH IT IS SUPPLIED WITHOUT PERMISSION IN WRITING FROM THE OWNER.
- C
- DATESTAMP OF THIS PRINT
- DRAWN BY:
- DOCUMENT NUMBER:
- SCHEMATIC FILENAME:
- PCB FILENAME:
- ENGINEER:
- APPROVED:
- CIRCUIT DIAGRAM
- DATE
- SHEET
- REVISION
- OF
- (in symbol CONN-PCB-18) VCC; D-; D+; GND; Type A
- (in symbol CONN-PCB-25) VCC; D-; D+; GND; Type B
- (in symbol IC-CPU-1, part E) UART; IIC0; IIC1_SPI; NAND Flash; Interface
- (in symbol IC-CPU-1, part F) USB 2.0 DEVICE; USB 2.0 PHY; HOST/DEVICE

### Library data of the parts
C42 C170-C175 C178-C180 C183 C188 C191-C198 = CAP-CER-1: as C276-C279 on sheet ppc_net; POD number: CAP-CER-1; RoHS: Y; Sort Value: 0.1; Category: Capacitors; Subcategory: Ceramic
  C42 C170-C175 C178-C180 C183 C188 C191 C193-C198: Value: 0.1uF
C176 C177 C185 = CAP-CER-3: 4.7uF, Ceramic Capacitor; Manufacturer: MURATA; PartNum: GRM21BR61E475KA12K; Tolerance: 10%; Dielectric: X5R; POD number: CAP-CER-3; Value: 4.7uF; RoHS: Y; Sort Value: 4.7; Category: Capacitors; Subcategory: Ceramic
C182 = CAP-TAN-0: 220uF, Solid Tantalum Chip Capacitor; Manufacturer: KEMET; PartNum: T491X227M010AT; Tolerance: 20%; ESR: 0.5; POD number: CAP-TAN-0; Value: 220uF; RoHS: Y; Sort Value: 220; Category: Capacitors; Subcategory: Tantalum
C184 = CAP-CER-4: as C275 on sheet ppc_net; POD number: CAP-CER-4; Value: 1000pF; RoHS: Y; Sort Value: 0.0001; Category: Capacitors; Subcategory: Ceramic
C186 C187 C189 C190 = CAP-CER-2: 22pF, Ceramic Capacitor; Manufacturer: MURATA; PartNum: GRM1555C1H220JA01D; Tolerance: 5%; Dielectric: C0G; POD number: CAP-CER-2; Value: 22pF; RoHS: Y; Sort Value: 0.000022; Category: Capacitors; Subcategory: Ceramic
DS28 = OPTO-LED-1: Red, Surface mount, LED, 1206; Manufacturer: LUMEX; Vdrop: 2V; Rating: 20mA; POD number: OPTO-LED-1; PartNum: SML-LX1206IC-TR; RoHS: Y; Category: OPTO; Subcategory: LED
F6 F7 = ELMECH-FUSE-0: Resettable, Surface mount Fuse; Manufacturer: Littelfuse; POD number: ELMECH-FUSE-0; PartNum: 1206L050-C; RoHS: Y; Category: ELMECH; Subcategory: Fuses
L18 L19 = IND-FB-0: as L21 on sheet ppc_net; POD number: IND-FB-0; RoHS: Y; Value: 600R; Sort Value: 600; Category: Inductors; Subcategory: FerriteBead
P3 = CONN-PCB-25: Right angle, Through-hole, USB Type B Receptacle; Manufacturer: Molex; POD number: CONN-PCB-25; PartNum: 67068-8001; RoHS: Y; Category: CONN; Subcategory: PCB
P4 = CONN-PCB-18: Right angle, Through-hole, USB Type A Receptacle; POD number: CONN-PCB-18; PartNum: 0894858001
P6 = CONN-PCB-12: 2x5, 2.54 mm Pitch, Male Header; Manufacturer: Molex; POD number: CONN-PCB-12; PartNum: 015912100; RoHS: Y; Category: CONN; Subcategory: PCB
P7 = CONN-PCB-16: 2x7, 2.54 mm Pitch, Male Header; Manufacturer: SAMTEC; POD number: CONN-PCB-16; PartNum: TSM-107-01-TM-DV-P; RoHS: Y; Category: CONN; Subcategory: PCB
Q11 = TRANS-NFET-0: N-Channel Logic Level Enhancement Mode Field Effect Transistor; Manufacturer: Fairchild Semiconductor; Rating: 0.22A; POD number: TRANS-NFET-0; PartNum: BSS138; RoHS: Y; Category: TRANS; Subcategory: NFET
R61 = RES-TF-19: 200R, 1.1mm x 0.5mm, Thick Film Resistor; Manufacturer: ROYALOHM; PartNum: 0402WGF0201T1E; Tolerance: 1%; Rating: 0.0625W; POD number: RES-TF-19; Value: 200R; Sort Value: 200; Category: Resistors; Subcategory: ThickFilm; HelpURL: *.pdf
R67 R72 R124-R126 R130 R131 R135#2 R136#2 R138 R139 R143 R144 R147-R149 R226 R243 R270 = RES-TF-0: as R229 on sheet ppc_net; POD number: RES-TF-0; Value: 0R; Sort Value: 0; Category: Resistors; Subcategory: ThickFilm; HelpURL: *.pdf
R127 R137 = RES-TF-7: 3K3, 1.1mm x 0.5mm, Thick Film Resistor; Manufacturer: ROYALOHM; PartNum: 0402WGJ0332T1E; Tolerance: 5%; Rating: 0.0625W; POD number: RES-TF-7; Value: 3K3; Sort Value: 3300; Category: Resistors; Subcategory: ThickFilm; HelpURL: *.pdf
R128 = RES-TF-2: 3K4, 1.1mm x 0.5mm, Thick Film Resistor; Manufacturer: ROYALOHM; PartNum: 0402WGF0342T1E; Rating: 0.0625W; POD number: RES-TF-2; Value: 3K4; Sort Value: 3400; Category: Resistors; Subcategory: ThickFilm; HelpURL: *.pdf
R129 = RES-TF-3: 12K, 1.1mm x 0.5mm, Thick Film Resistor; Manufacturer: ROYALOHM; PartNum: 0402WGF0123T1E; Rating: 0.0625W; POD number: RES-TF-3; Value: 12K; Sort Value: 12000; Category: Resistors; Subcategory: ThickFilm; HelpURL: *.pdf
R132-R134 R150 R492 = RES-TF-5: as R235 on sheet ppc_net; POD number: RES-TF-5; Value: 10K; Sort Value: 10000; Category: Resistors; Subcategory: ThickFilm; HelpURL: *.pdf
R140-R142 R145 R146 R491 = RES-TF-8: as R238 on sheet ppc_net; POD number: RES-TF-8; Value: 1K; Sort Value: 1000; Category: Resistors; Subcategory: ThickFilm; HelpURL: *.pdf
SP1 SP2 = ELMECH-ESD-4: Ultra-low Capacitance, Surface mount ESD Suppressor; Manufacturer: Littelfuse; POD number: ELMECH-ESD-4; PartNum: PGB102ST23WR; RoHS: Y; Category: ELMECH; Subcategory: ESD Suppressors
SP4-SP8 = ELMECH-ESD-3: as SP9-SP16 on sheet ppc_net; POD number: ELMECH-ESD-3; PartNum: PGB1010402
TP39 = ELMECH-TP-0: as TP3 on sheet ppc_net; POD number: ELMECH-TP-0; RoHS: Y; Category: ELMECH; Subcategory: Test Points
U2 = IC-CPU-1: as U2 on sheet ppc_net; POD number: IC-CPU-1; PartNum: PPC440EPX-NUA667T; RoHS: Y; Category: IC; Subcategory: CPU
U31 U83 U88 = IC-LOG-13: Single-Bit Dual Supply Bus Transceiver with Configurable Voltage Translation and 3-State Outputs; Manufacturer: Texas Instruments; POD number: IC-LOG-13; PartNum: SN74AVCH1T45; RoHS: Y; Category: IC; Subcategory: Logic
U33 = IC-IF-0: Quad High Speed USB to Multipurpose UART/MPSSE; Manufacturer: FTDI; POD number: IC-IF-0; PartNum: FT4232HL; RoHS: Y; Category: IC; Subcategory: Interface
U34 = IC-MEM-3: 2K Microwire Compatible Serial EEPROM; Manufacturer: Microchip; PartNum: 93LC56B/SN; POD number: IC-MEM-3; RoHS: Y; Category: IC; Subcategory: Memory
U35 U37 U39 U87 U89 = IC-LOG-5: Low voltage SPDT Analogue Switch; Manufacturer: PERICOM; POD number: IC-LOG-5; PartNum: PI5A3157ZAEX; RoHS: Y; Category: IC; Subcategory: Logic
U36 = IC-LOG-9: Low-power RS232 transceivers; Manufacturer: Intersil; POD number: IC-LOG-9; PartNum: ICL3225EIAZ; RoHS: Y; Category: IC; Subcategory: Logic
U38 = IC-MEM-4: 4K Serial EEPROM; Manufacturer: Atmel; POD number: IC-MEM-4; PartNum: AT24HC04B; RoHS: Y; Category: IC; Subcategory: Memory
VR1 VR2 = ELMECH-ESD-2: Multilayer Transient Voltage Surge Suppressing Varistor; Manufacturer: Littelfuse; POD number: ELMECH-ESD-2; PartNum: V5.5MLA0603; RoHS: Y; Category: ELMECH; Subcategory: ESD Suppressors
Y3 = RESN-XTAL-3: 48 MHz, Surface mount, Crystal Oscillator; POD number: RESN-XTAL-3
Y4 = RESN-XTAL-4: 12 MHz, Surface mount, Crystal Oscillator; Manufacturer: CTS; Stability: 50 PPM; Load Capacitance: 18 pF; POD number: RESN-XTAL-4; PartNum: 405C35D12M00000; RoHS: Y; Category: RESN; Subcategory: Crystal Oscillator

## Sheet ppc_sys.SchDoc: PowerPC System Circuits
size A3; Date: DO NOT USE, RATHER USE PROJ OPTIONS; DrawnBy: DO NOT USE, RATHER USE PROJ OPTIONS; Engineer: DO NOT USE, RATHER USE PROJ OPTIONS; Organization: DO NOT USE, RATHER USE PROJ OPTIONS; DocumentNumber: DO NOT USE, RATHER USE PROJ OPTIONS; Revision: DO NOT USE, RATHER USE PROJ OPTIONS; SheetNumber: 5; SheetTotal: 29; SCH_Sheet_Filename: ppc_sys.SchDoc; CurrentTime: DO NOT USE, RATHER USE PROJ OPTIONS; Time: DO NOT USE, RATHER USE PROJ OPTIONS; DocumentFullPathAndName: DO NOT USE, RATHER USE PROJ OPTIONS; DocumentName: DO NOT USE, RATHER USE PROJ OPTIONS; ModifiedDate: DO NOT USE, RATHER USE PROJ OPTIONS; ImagePath: DO NOT USE, RATHER USE PROJ OPTIONS
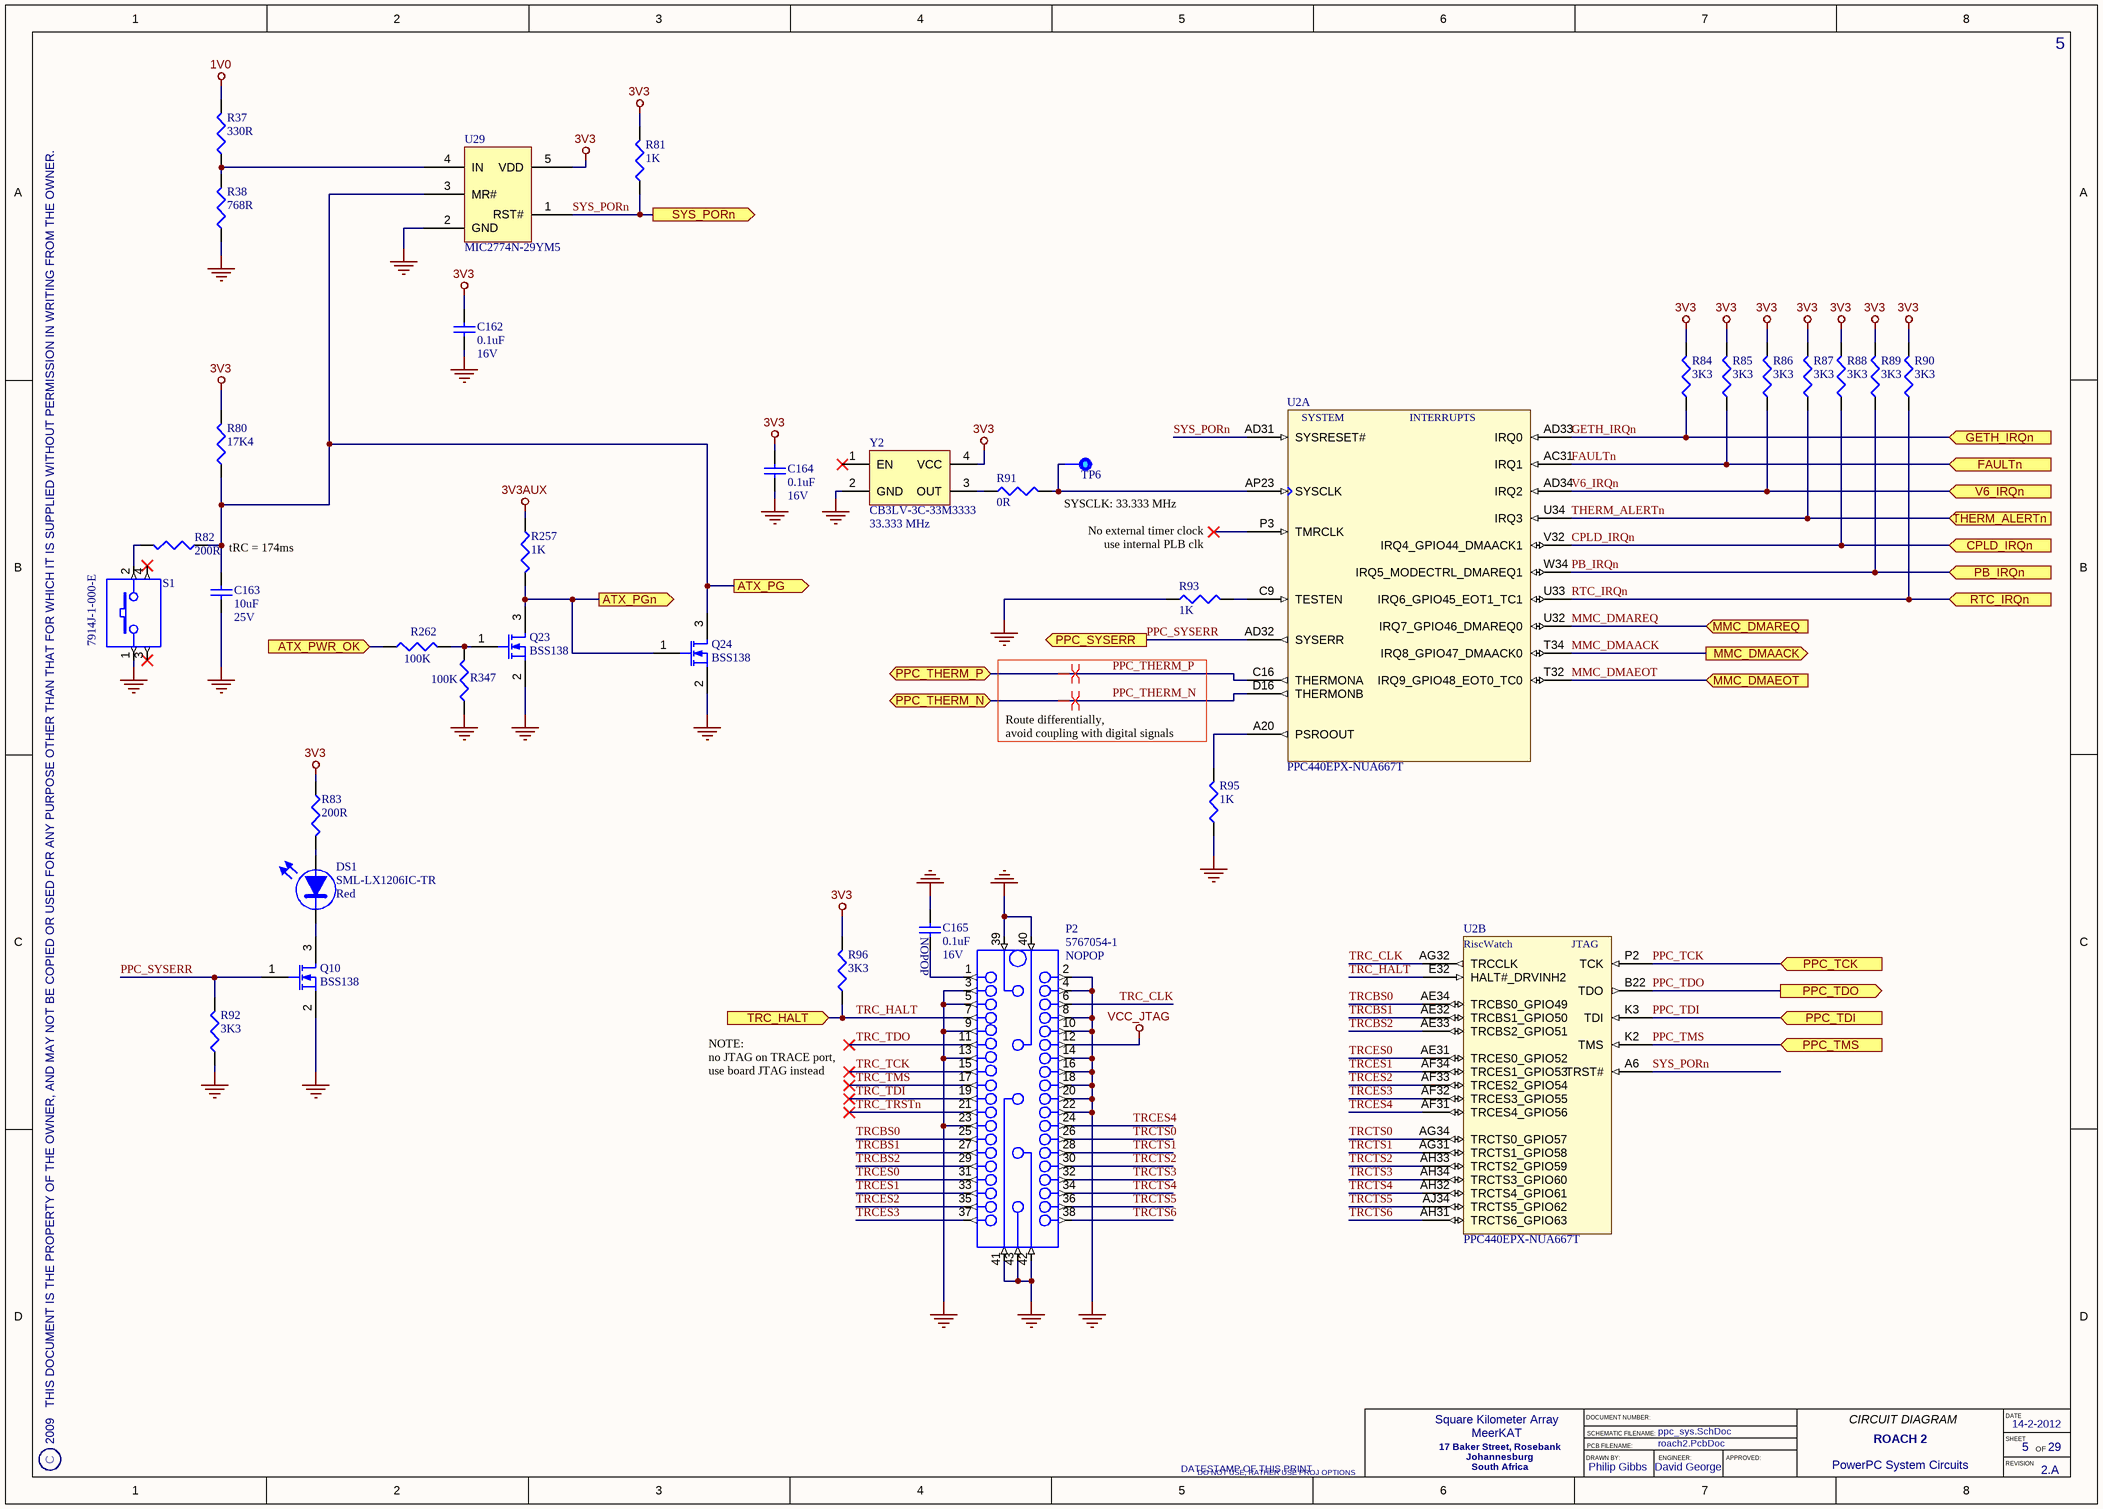
[diagram p10: ppc_sys.SchDoc]

### Parts
C162  Rating: 16V  [CAPC1005X60L]  (hidden comment: 0.1uF)
C163  Rating: 25V  [CAPC3225X200L]  (hidden comment: 10uF)
C164  Rating: 16V  [CAPC1005X60L]  (hidden comment: 0.1uF)
C165  Rating: 16V  [CAPC1005X60L]  (hidden comment: 0.1uF)
DS1  SML-LX1206IC-TR  Colour: Red  [LEDC3216X120N]
P2  5767054-1  [TYCO_5767054-1]
Q10  BSS138  [SOT95P245X110-3N]
Q23  BSS138  [SOT95P245X110-3N]
Q24  BSS138  [SOT95P245X110-3N]
R37  330R  [RESC1005X40L]
R38  768R  [RESC1005X40L]
R80  value 17K4  [RESC1005X40L]  (hidden comment: ResStd)
R81  1K  [RESC1005X40L]
R82  200R  [RESC1005X40L]
R83  200R  [RESC1005X40L]
R84  3K3  [RESC1005X40L]
R85  3K3  [RESC1005X40L]
R86  3K3  [RESC1005X40L]
R87  3K3  [RESC1005X40L]
R88  3K3  [RESC1005X40L]
R89  3K3  [RESC1005X40L]
R90  3K3  [RESC1005X40L]
R91  0R  [RESC1005X40L]
R92  3K3  [RESC1005X40L]
R93  1K  [RESC1005X40L]
R95  1K  [RESC1005X40L]
R96  3K3  [RESC1005X40L]
R257  1K  [RESC1005X40L]
R262  100K  [RESC1005X40L]
R347  100K  [RESC1005X40L]
S1  7914J-1-000-E  [7914J-X-XXX-X]
TP6  Testpoint  [TP100]  (value not drawn)  (no BOM)
U2  PPC440EPX-NUA667T  [TE-PBGA680]  (parts A,B of 11)
U29  MIC2774N-29YM5  [SOT23-5]
Y2  Frequency: 33.333 MHz  [CB3X-X-XMX]  (hidden comment: CB3LV-3C-33M3333)

### Ports
ATX_PG (out), ATX_PGn (out), ATX_PWR_OK (in), CPLD_IRQn (in), FAULTn (in), GETH_IRQn (in), MMC_DMAACK (out), MMC_DMAEOT (in), MMC_DMAREQ (in), PB_IRQn (in), PPC_SYSERR (out), PPC_TCK (in), PPC_TDI (in), PPC_TDO (out), PPC_THERM_N, PPC_THERM_P, PPC_TMS (in), RTC_IRQn (in), SYS_PORn (out), THERM_ALERTn (in), TRC_HALT (in), V6_IRQn (in)

### Nets
1V0: R37.2
3V3: C162.2 C164.2 R80.2 R81.2 R83.1 R84.2 R85.2 R86.2 R87.2 R88.2 R89.2 R90.2 R96.2 U29.5(VDD) Y2.4(VCC)
3V3AUX: R257.1
GND: C162.1 C163.1 C164.1 C165.2 P2.2 P2.3 P2.4 P2.5 P2.8 P2.9 P2.10 P2.13 P2.14 P2.16 P2.18 P2.20 P2.22 P2.23 P2.39 P2.40 P2.41 P2.42 P2.43 Q10.2(S) Q23.2(S) Q24.2(S) R38.1 R92.1 R93.1 R95.1 R347.1 S1.1 U29.2(GND) Y2.2(GND)
VCC_JTAG: P2.12
CPLD_IRQn: R88.1 U2.V32(IRQ4_GPIO44_DMAACK1) ; port CPLD_IRQn
FAULTn: R85.1 U2.AC31(IRQ1) ; port FAULTn
GETH_IRQn: R84.1 U2.AD33(IRQ0) ; port GETH_IRQn
MMC_DMAACK: U2.T34(IRQ8_GPIO47_DMAACK0) ; port MMC_DMAACK
MMC_DMAEOT: U2.T32(IRQ9_GPIO48_EOT0_TC0) ; port MMC_DMAEOT
MMC_DMAREQ: U2.U32(IRQ7_GPIO46_DMAREQ0) ; port MMC_DMAREQ
PB_IRQn: R89.1 U2.W34(IRQ5_MODECTRL_DMAREQ1) ; port PB_IRQn
PPC_SYSERR: Q10.1(G) R92.2 U2.AD32(SYSERR) ; port PPC_SYSERR
PPC_TCK: U2.P2(TCK) ; port PPC_TCK
PPC_TDI: U2.K3(TDI) ; port PPC_TDI
PPC_TDO: U2.B22(TDO) ; port PPC_TDO
PPC_THERM_N: U2.D16(THERMONB) ; port PPC_THERM_N
PPC_THERM_P: U2.C16(THERMONA) ; port PPC_THERM_P
PPC_TMS: U2.K2(TMS) ; port PPC_TMS
RTC_IRQn: R90.1 U2.U33(IRQ6_GPIO45_EOT1_TC1) ; port RTC_IRQn
SYS_PORn: R81.1 U2.A6(TRST#) U2.AD31(SYSRESET#) U29.1(RST#) ; port SYS_PORn
THERM_ALERTn: R87.1 U2.U34(IRQ3) ; port THERM_ALERTn
TRC_CLK: P2.6 U2.AG32(TRCCLK)
TRC_HALT: P2.7 R96.1 U2.E32(HALT#_DRVINH2) ; port TRC_HALT
TRC_TCK: P2.15
TRC_TDI: P2.19
TRC_TDO: P2.11
TRC_TMS: P2.17
TRC_TRSTn: P2.21
TRCBS0: P2.25 U2.AE34(TRCBS0_GPIO49)
TRCBS1: P2.27 U2.AE32(TRCBS1_GPIO50)
TRCBS2: P2.29 U2.AE33(TRCBS2_GPIO51)
TRCES0: P2.31 U2.AE31(TRCES0_GPIO52)
TRCES1: P2.33 U2.AF34(TRCES1_GPIO53)
TRCES2: P2.35 U2.AF33(TRCES2_GPIO54)
TRCES3: P2.37 U2.AF32(TRCES3_GPIO55)
TRCES4: P2.24 U2.AF31(TRCES4_GPIO56)
TRCTS0: P2.26 U2.AG34(TRCTS0_GPIO57)
TRCTS1: P2.28 U2.AG31(TRCTS1_GPIO58)
TRCTS2: P2.30 U2.AH33(TRCTS2_GPIO59)
TRCTS3: P2.32 U2.AH34(TRCTS3_GPIO60)
TRCTS4: P2.34 U2.AH32(TRCTS4_GPIO61)
TRCTS5: P2.36 U2.AJ34(TRCTS5_GPIO62)
TRCTS6: P2.38 U2.AH31(TRCTS6_GPIO63)
V6_IRQn: R86.1 U2.AD34(IRQ2) ; port V6_IRQn
NetC163_2: C163.2 Q24.3(D) R80.1 R82.1 U29.3(MR#) ; port ATX_PG
NetC165_1: C165.1 P2.1
NetDS1_1: DS1.1(K) Q10.3(D)
NetDS1_2: DS1.2(A) R83.2
NetQ23_1: Q23.1(G) R262.2 R347.2
NetQ23_3: Q23.3(D) Q24.1(G) R257.2 ; port ATX_PGn
NetR37_1: R37.1 R38.2 U29.4(IN)
NetR82_2: R82.2 S1.2
NetR91_1: R91.1 Y2.3(OUT)
NetR91_2: R91.2 TP6.1 U2.AP23(SYSCLK)
NetR93_2: R93.2 U2.C9(TESTEN)
NetR95_2: R95.2 U2.A20(PSROOUT)
NetR262_1: R262.1 ; port ATX_PWR_OK

Not connected (* = marked no-connect by the designer): S1 3* 4*; U2 P3(TMRCLK)*; Y2 1(EN)*

### Layout directives
differential pair: PPC_THERM_N, PPC_THERM_P

### Notes on the sheet
- SYSCLK: 33.333 MHz
- (near C163) tRC = 174ms
- No external timer clock
  use internal PLB clk
- (near R95) Route differentially,
  avoid coupling with digital signals
- (near C165) NOPOP
- (near P2) NOPOP
- (near R96) NOTE:
  no JTAG on TRACE port,
  use board JTAG instead
- 2009   THIS DOCUMENT IS THE PROPERTY OF THE OWNER, AND MAY NOT BE COPIED OR USED FOR ANY PURPOSE OTHER THAN THAT FOR WHICH IT IS SUPPLIED WITHOUT PERMISSION IN WRITING FROM THE OWNER.
- C
- DATESTAMP OF THIS PRINT
- DRAWN BY:
- DOCUMENT NUMBER:
- SCHEMATIC FILENAME:
- PCB FILENAME:
- ENGINEER:
- APPROVED:
- CIRCUIT DIAGRAM
- DATE
- SHEET
- REVISION
- OF
- (in symbol IC-CPU-1, part A) SYSTEM; INTERRUPTS
- (in symbol IC-CPU-1, part B) RiscWatch; JTAG

### Library data of the parts
C162 C164 C165 = CAP-CER-1: as C276-C279 on sheet ppc_net; POD number: CAP-CER-1; Value: 0.1uF; RoHS: Y; Sort Value: 0.1; Category: Capacitors; Subcategory: Ceramic
C163 = CAP-CER-5: as C274 on sheet ppc_net; POD number: CAP-CER-5; Value: 10uF; RoHS: Y; Sort Value: 100; Category: Capacitors; Subcategory: Ceramic
DS1 = OPTO-LED-1: as DS28 on sheet ppc_serial; POD number: OPTO-LED-1; PartNum: SML-LX1206IC-TR; RoHS: Y; Category: OPTO; Subcategory: LED
P2 = CONN-PCB-9: TRACE Debug Interface Receptacle; Manufacturer: TYCO; POD number: CONN-PCB-9; PartNum: 5767054-1; RoHS: Y; Category: CONN; Subcategory: PCB
Q10 Q23 Q24 = TRANS-NFET-0: as Q11 on sheet ppc_serial; POD number: TRANS-NFET-0; PartNum: BSS138; RoHS: Y; Category: TRANS; Subcategory: NFET
R37 = RES-TF-1: 330R, 1.1mm x 0.5mm, Thick Film Resistor; Manufacturer: ROYALOHM; PartNum: 0402WGF0331T1E; Tolerance: 1%; Rating: 0.0625W; POD number: RES-TF-1; RoHS: Y; Value: 330R; Sort Value: 330; Category: Resistors; Subcategory: ThickFilm; HelpURL: http://www.royalohm.com/pdf/general.pdf
R38 = RES-TF-48: 768R, 1.1mm x 0.5mm, Thick Film Resistor; Manufacturer: ROYALOHM; PartNum: 0402WGF7680T1E; Tolerance: 1%; Rating: 0.0625W; POD number: RES-TF-48; RoHS: Y; Value: 768R; Sort Value: 768; Category: Resistors; Subcategory: ThickFilm; HelpURL: http://www.royalohm.com/pdf/general.pdf
R80 = RES-TF-30: 17K4, 1.1mm x 0.5mm, Thick Film Resistor; POD number: RES-TF-30
R81 R93 R95 R257 = RES-TF-8: as R238 on sheet ppc_net; POD number: RES-TF-8; Value: 1K; Sort Value: 1000; Category: Resistors; Subcategory: ThickFilm
  R81 R257: RoHS: Y; HelpURL: http://www.royalohm.com/pdf/general.pdf
  R93 R95: HelpURL: *.pdf
R82 R83 = RES-TF-19: as R61 on sheet ppc_serial; POD number: RES-TF-19; Value: 200R; Sort Value: 200; Category: Resistors; Subcategory: ThickFilm; HelpURL: *.pdf
R84-R90 R92 R96 = RES-TF-7: as R127 on sheet ppc_serial; POD number: RES-TF-7; Value: 3K3; Sort Value: 3300; Category: Resistors; Subcategory: ThickFilm; HelpURL: *.pdf
R91 = RES-TF-0: as R229 on sheet ppc_net; POD number: RES-TF-0; Value: 0R; Sort Value: 0; Category: Resistors; Subcategory: ThickFilm; HelpURL: *.pdf
R262 R347 = RES-TF-51: 100K, 1.1mm x 0.5mm, Thick Film Resistor; Manufacturer: ROYALOHM; PartNum: 0402WGF1003T1E; Tolerance: 1%; Rating: 0.0625W; POD number: RES-TF-51; RoHS: Y; Value: 100K; Sort Value: 100000; Category: Resistors; Subcategory: ThickFilm; HelpURL: http://www.royalohm.com/pdf/general.pdf
S1 = ELMECH-SW-1: 4mm, Surface mount, Sealed Key Switch; Manufacturer: BOURNS; POD number: ELMECH-SW-1; PartNum: 7914J-1-000-E; RoHS: Y; Category: ELMECH; Subcategory: Switches
TP6 = ELMECH-TP-0: as TP3 on sheet ppc_net; POD number: ELMECH-TP-0; RoHS: Y; Category: ELMECH; Subcategory: Test Points
U2 = IC-CPU-1: as U2 on sheet ppc_net; POD number: IC-CPU-1; PartNum: PPC440EPX-NUA667T; RoHS: Y; Category: IC; Subcategory: CPU
U29 = IC-MON-4: Dual-power low voltage supervisor; Manufacturer: Micrel; POD number: IC-MON-4; PartNum: MIC2774N-29YM5; RoHS: Y; Category: IC; Subcategory: Monitoring
Y2 = RESN-CLK-1: Surface mount, 33.3333 MHz, 3V3 Clock, oscillator; Manufacturer: CTS; POD number: RESN-CLK-1; PartNum: CB3LV-3C-33M3333; RoHS: Y; Category: RESN; Subcategory: Clock Oscillators